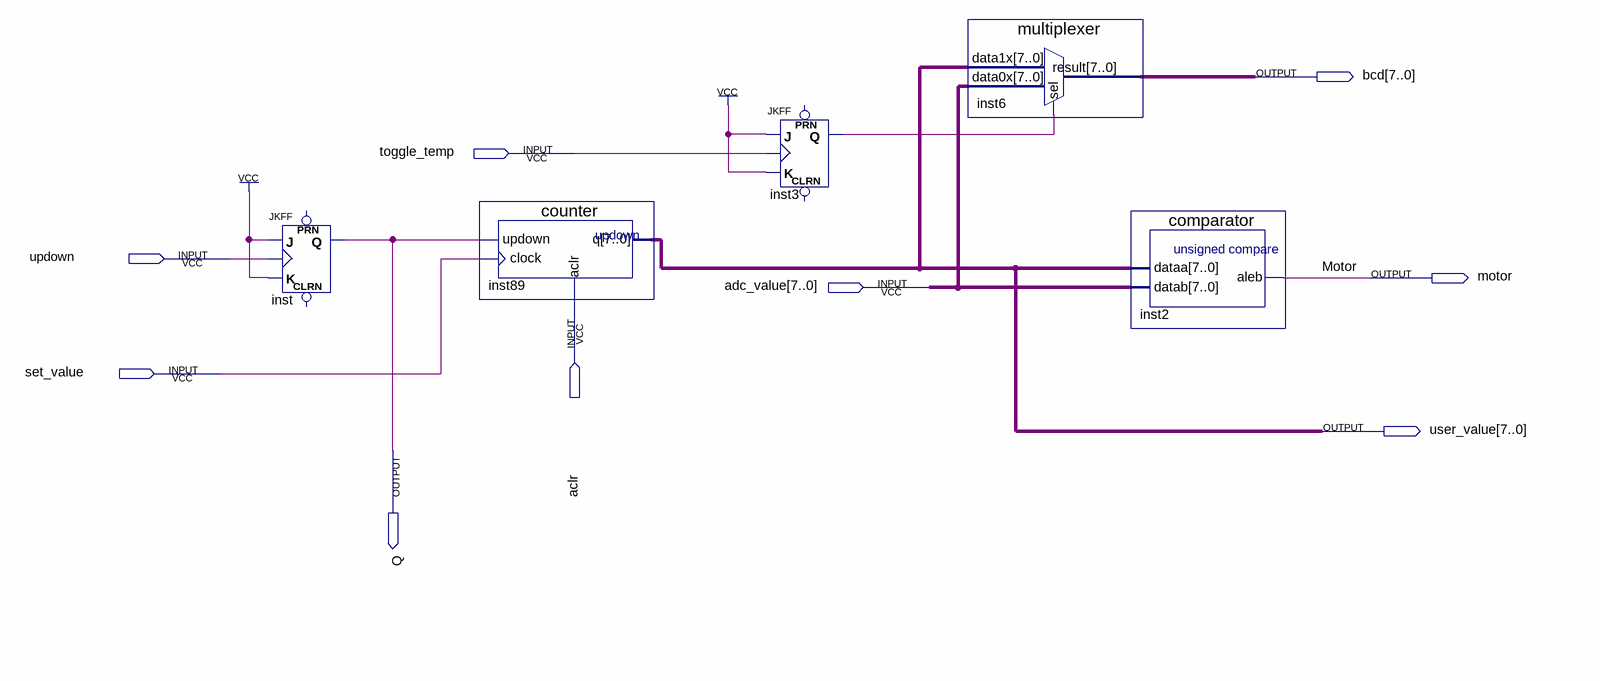
[diagram p0: schematic sheet]
// Quartus schematic contador_bidireccional.bdf as structural Verilog: 5 symbols, 9 pins
module contador_bidireccional (
  input  toggle_temp,
  input  updown,
  input  [7:0] adc_value,
  input  aclr,
  input  set_value,
  output [7:0] bcd,
  output motor,
  output [7:0] user_value,
  output Q
);

  wire inst3_q;

  JKFF inst (.K(1'b1), .J(1'b1), .CLK(updown), .Q(Q));  // open: PRN, CLRN
  counter inst89 (.updown(Q), .clock(set_value), .aclr(aclr), .q(user_value));
  JKFF inst3 (.K(1'b1), .J(1'b1), .CLK(toggle_temp), .Q(inst3_q));  // open: PRN, CLRN
  multiplexer inst6 (.data1x(user_value), .data0x(adc_value), .sel(inst3_q), .result(bcd));
  comparator inst2 (.dataa(user_value), .datab(adc_value), .aleb(motor));
endmodule
